# EAGLE design Light (EAGLE 7.5.0)
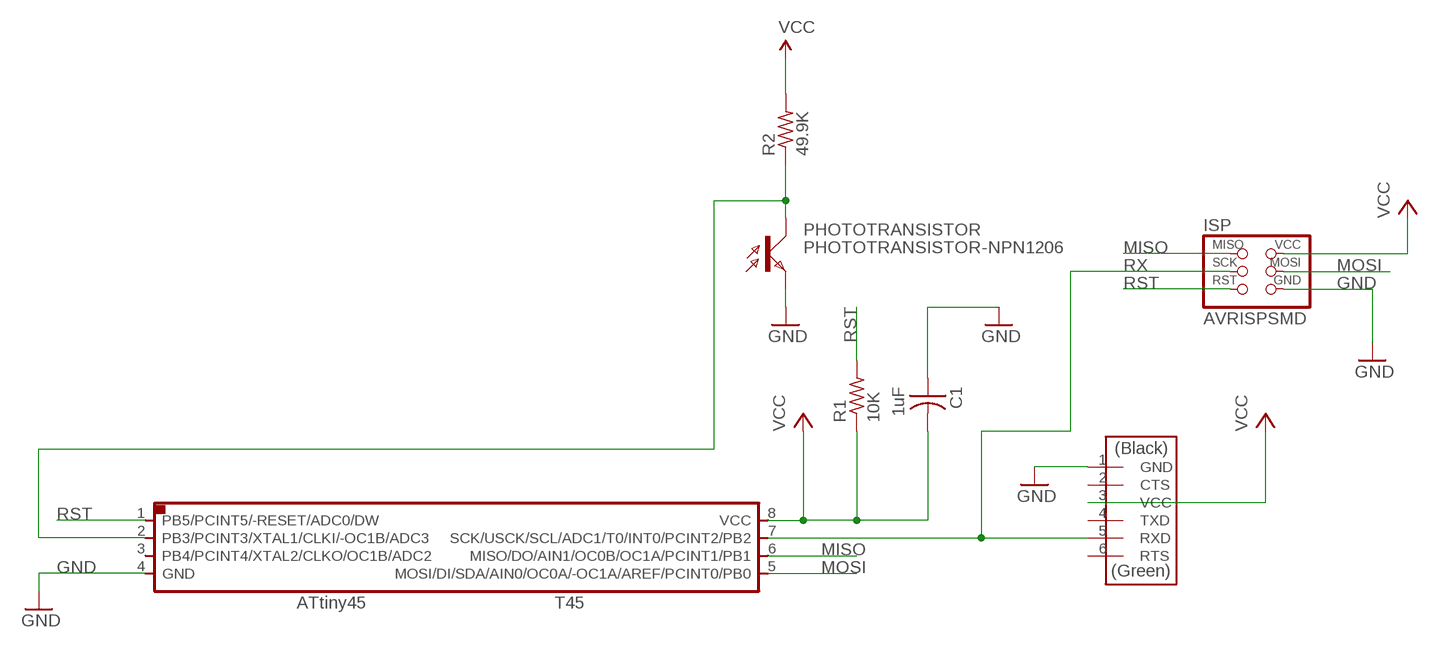
[diagram p0: schematic, sheet 1]

## Parts
C1  1uF  CAP-US1206FAB  [C1206FAB]
FDTI  FTDI-SMD-HEADER  [1X06SMD]
ISP  AVRISPSMD  [2X03SMD]
PHOTOTRANSISTOR  PHOTOTRANSISTOR-NPN1206  [OP1206]
R1  10K  RES-US1206FAB  [R1206FAB]
R2  49.9K  RES-US1206FAB  [R1206FAB]
T45  ATTINY45SI  [SOIC8]

## Nets
GND: C1.1 FDTI.1(GND) ISP.6(GND) PHOTOTRANSISTOR.EMITTER(E) T45.4(GND)
MISO: ISP.1(MISO) T45.6(MISO/DO/AIN1/OC0B/OC1A/PCINT1/PB1)
MOSI: ISP.4(MOSI) T45.5(MOSI/DI/SDA/AIN0/OC0A/-OC1A/AREF/PCINT0/PB0)
N$2: PHOTOTRANSISTOR.COLLECTOR(C) R2.1 T45.2(PB3/PCINT3/XTAL1/CLKI/-OC1B/ADC3)
RST: ISP.5(RST) R1.2 T45.1(PB5/PCINT5/-RESET/ADC0/DW)
RX: FDTI.5(RXD) ISP.3(SCK) T45.7(SCK/USCK/SCL/ADC1/T0/INT0/PCINT2/PB2)
VCC: C1.2 FDTI.3(VCC) ISP.2(VCC) R1.1 R2.2 T45.8(VCC)
Unconnected: FDTI.2(CTS) FDTI.4(TXD) FDTI.6(RTS) T45.3(PB4/PCINT4/XTAL2/CLKO/OC1B/ADC2)

## Library data of the parts
C1 = fab:CAP-US
FDTI = fab:FTDI-SMD-HEADER
ISP = fab:AVRISP
PHOTOTRANSISTOR = fab:PHOTOTRANSISTOR-NPN
R1 R2 = fab:RES-US: Resistor (US Symbol) Variants with postfix FAB are widened to allow the routing of internal traces
T45 = fab:ATTINY45

## Board
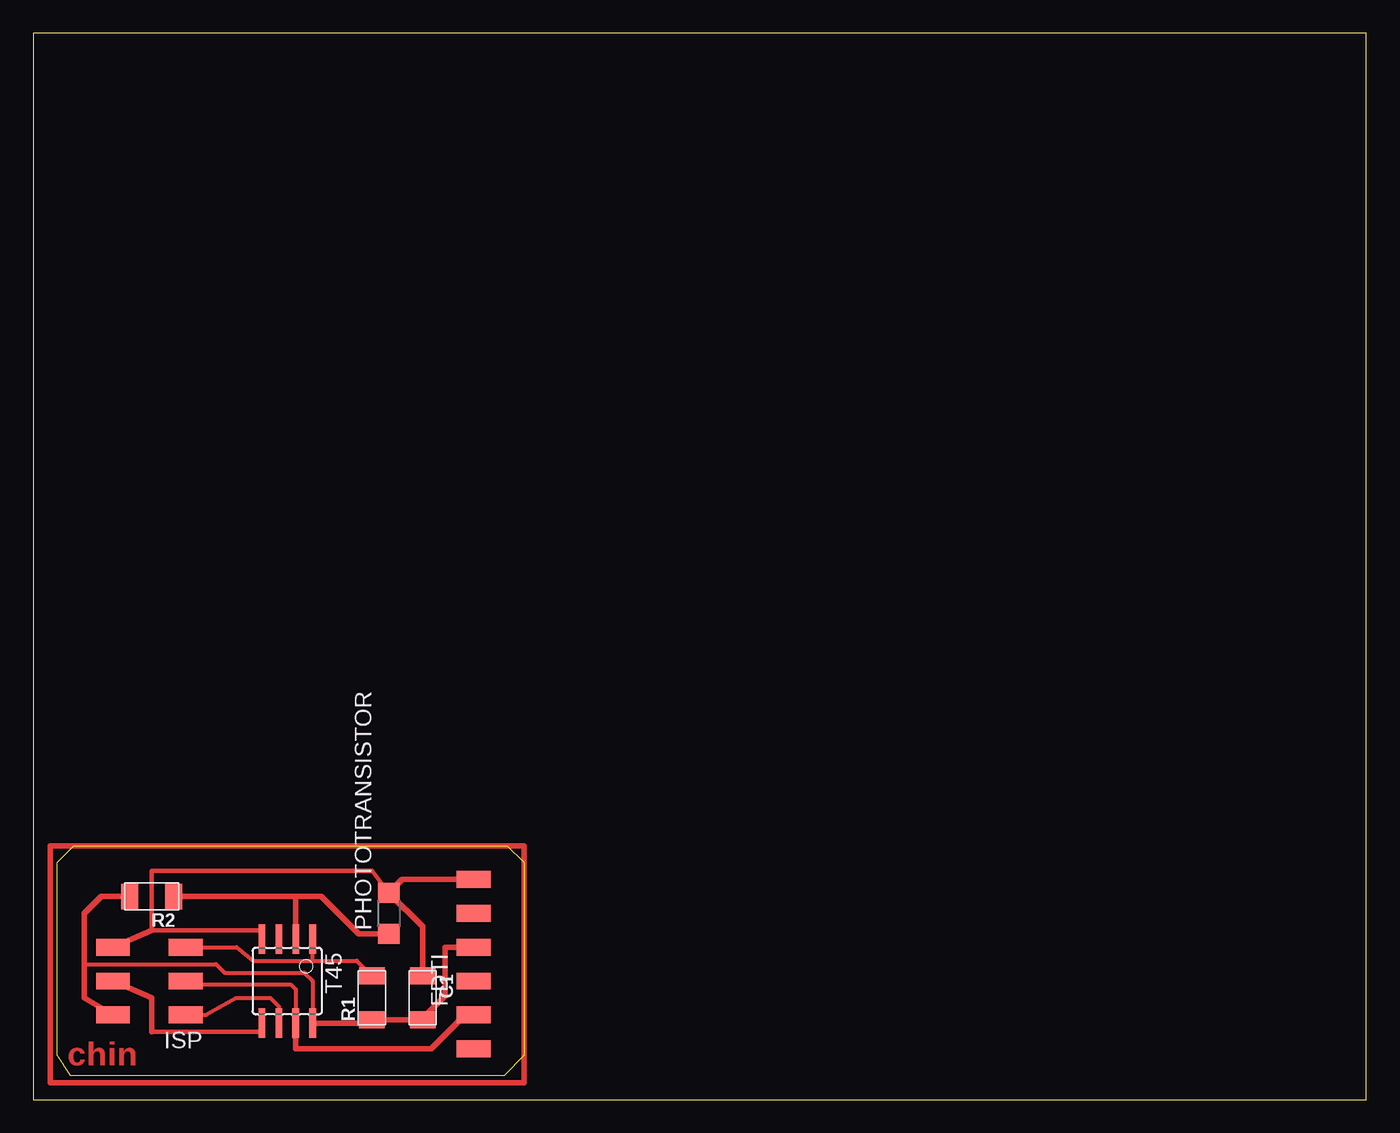
[diagram p1: board, top side]

Size 100 x 80 mm. Coordinates in mm from the lower left corner, seen from the top.
Outline: 0,0 100,0 100,80 0,80 0,0
Copper layers (1*16): Top 0.035mm / dielectric 1.5mm / Bottom 0.035mm
Design rules "default": minimum track width 10mil, minimum drill 24mil, track to track 8mil, track to pad 8mil, pad to pad 8mil, via to via 8mil, smd to smd 8mil, copper to edge 40mil, drill to drill 8mil, minimum pad ring 10mil, minimum via ring 8mil, stop-mask expansion 4mil, vias tented up to drill 0mil, thermal gap 10mil

### Footprints (pad centres in the part's own frame; a part is rotated, then mirrored left to right if it is on the bottom)
C1206FAB = smd 1.27 x 1.905: 1 -1.651,0; 2 1.651,0
1X06SMD = smd 2.54 x 1.27: 1 0,6.35; 2 0,3.81; 3 0,1.27; 4 0,-1.27; 5 0,-3.81; 6 0,-6.35
2X03SMD = smd 2.54 x 1.27: 1 -2.54,2.54; 2 2.92,2.54; 3 -2.54,0; 4 2.92,0; 5 -2.54,-2.54; 6 2.92,-2.54
OP1206 = smd 1.5 x 1.6: COLLECTOR -1.55,0; EMITTER 1.55,0
R1206FAB = smd 1.27 x 1.905: 1 -1.651,0; 2 1.651,0
SOIC8 = smd 0.5 x 2.2: 1 -1.905,-3.154; 2 -0.645,-3.154; 3 0.625,-3.154; 4 1.895,-3.154; 5 1.905,3.154; 6 0.635,3.154; 7 -0.635,3.154; 8 -1.905,3.154

### Placement (x,y rotation side)
C1  29.21,7.62 270 top
FDTI  33.02,10.16 0 top
ISP  8.89,8.89 180 top
PHOTOTRANSISTOR  26.67,13.97 90 top
R1  25.4,7.62 90 top
R2  8.89,15.24 180 top
T45  19.05,8.89 180 top

### Tracks (layer width: path | path; a pad name or v marks a point on that pad's centre or on a via)
GND
  Top 0.356: T45.4 17.16,12.7 8.89,12.7 8.89,17.14 25.4,17.14 PHOTOTRANSISTOR.EMITTER
  Top 0.406: C1.1 29.21,12.98 PHOTOTRANSISTOR.EMITTER 27.66,16.51 FDTI.1 | ISP.6 8.89,12.7
MISO
  Top 0.305: ISP.1 12.95,6.35 15.24,7.62 17.78,7.62 18.41,6.99 T45.6
MOSI
  Top 0.356: 8.89,5.08 17.14,5.08 T45.5
  Top 0.406: ISP.4 8.89,7.62 8.89,5.08
N$1  (8 unrouted)
N$2
  Top 0.406: R2.1 19.7,15.24 | 19.7,15.24 21.59,15.24 24.41,12.42 PHOTOTRANSISTOR.COLLECTOR | 19.68,12.05 T45.2 19.7,15.24
N$3
  Top 0.406: 1.27,19.05 36.83,19.05 36.83,1.27 1.27,1.27 1.27,19.05
RST
  Top 0.305: 20.95,10.41 T45.1 | 20.95,10.41 24.26,10.41 R1.2 | ISP.5 15.24,11.43 16.51,10.41 20.95,10.41
RX
  Top 0.305: ISP.3 10.92,8.89 11.94,8.64 19.3,8.64 19.68,8.26 T45.7
  Top 0.406: T45.7 19.68,3.81 29.84,3.81 32.38,6.35 FDTI.5
VCC
  Top 0.254: 32.94,11.43 FDTI.3 | 29.29,6.17 C1.2 | 20.83,6.63 20.83,5.94 T45.8
  Top 0.305: 3.81,10.06 3.91,10.16 13.72,10.16 14.35,9.53 20.32,9.53 20.95,8.89 T45.8
  Top 0.406: T45.8 25.17,5.74 25.17,6.35 25.4,6.35 R1.1 C1.2 | R2.2 5.08,15.24 3.81,13.97 3.81,10.06 3.81,7.62 ISP.2 | 32.94,11.43 30.91,11.43 30.91,7.8 29.29,6.17

### Text on the board
Top: chin